# EAGLE design 2364-27c128 adapter (EAGLE 9.0.1)
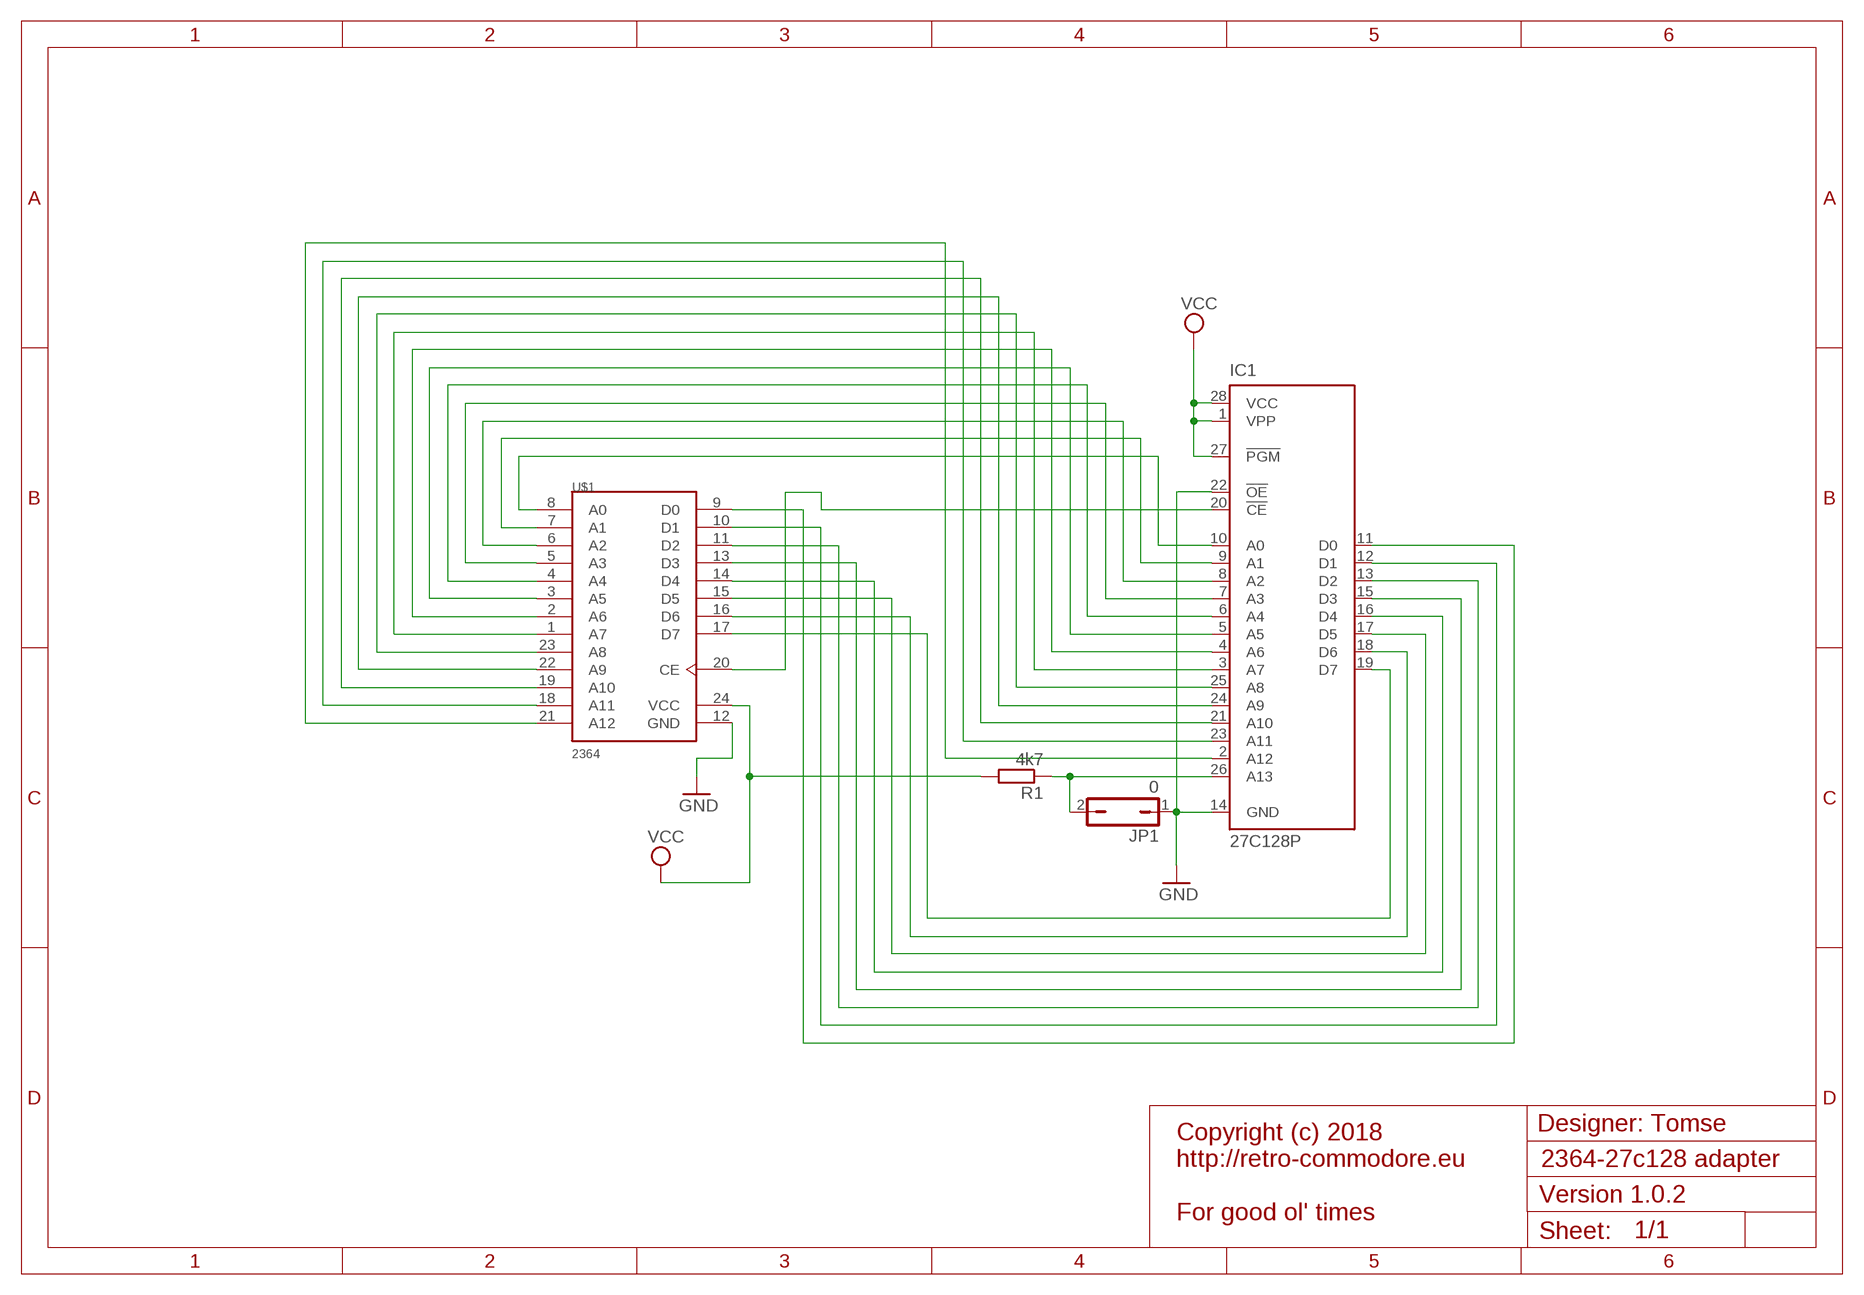
[diagram p0: schematic, sheet 1]

## Parts
IC1  27C128P  [DIL28-6]
JP1  0  JP1Q  [JP1]
R1  4k7  R-EU_0207/12  [0207/12]
U$1  2364  [DIP24]

## Nets
GND: IC1.14(GND) IC1.22(!OE) JP1.1 U$1.12(GND)
N$1: IC1.10(A0) U$1.8(A0)
N$2: IC1.9(A1) U$1.7(A1)
N$3: IC1.8(A2) U$1.6(A2)
N$4: IC1.7(A3) U$1.5(A3)
N$5: IC1.6(A4) U$1.4(A4)
N$6: IC1.5(A5) U$1.3(A5)
N$7: IC1.4(A6) U$1.2(A6)
N$8: IC1.3(A7) U$1.1(A7)
N$9: IC1.25(A8) U$1.23(A8)
N$10: IC1.24(A9) U$1.22(A9)
N$11: IC1.21(A10) U$1.19(A10)
N$12: IC1.23(A11) U$1.18(A11)
N$13: IC1.2(A12) U$1.21(A12)
N$14: IC1.19(D7) U$1.17(D7)
N$15: IC1.18(D6) U$1.16(D6)
N$16: IC1.17(D5) U$1.15(D5)
N$17: IC1.16(D4) U$1.14(D4)
N$18: IC1.15(D3) U$1.13(D3)
N$19: IC1.13(D2) U$1.11(D2)
N$20: IC1.12(D1) U$1.10(D1)
N$21: IC1.11(D0) U$1.9(D0)
N$22: IC1.20(!CE) U$1.20(CE)
N$24: IC1.26(A13) JP1.2 R1.1
VCC: IC1.1(VPP) IC1.27(!PGM) IC1.28(VCC) R1.2 U$1.24(VCC)

## Notes on the sheet
- Designer: Tomse
- Version 1.0.2
- Copyright (c) 2018
  http://retro-commodore.eu
  
  For good ol' times

## Library data of the parts
IC1 = microchip:27*128: CMOS EPROM 128 K (16 K x 8); OC_FARNELL: unknown; OC_NEWARK: unknown
JP1 = jumper:JP1Q: JUMPER
R1 = resistor:R-EU_: RESISTOR, European symbol
U$1 = 65xx_mos:2364

## Board
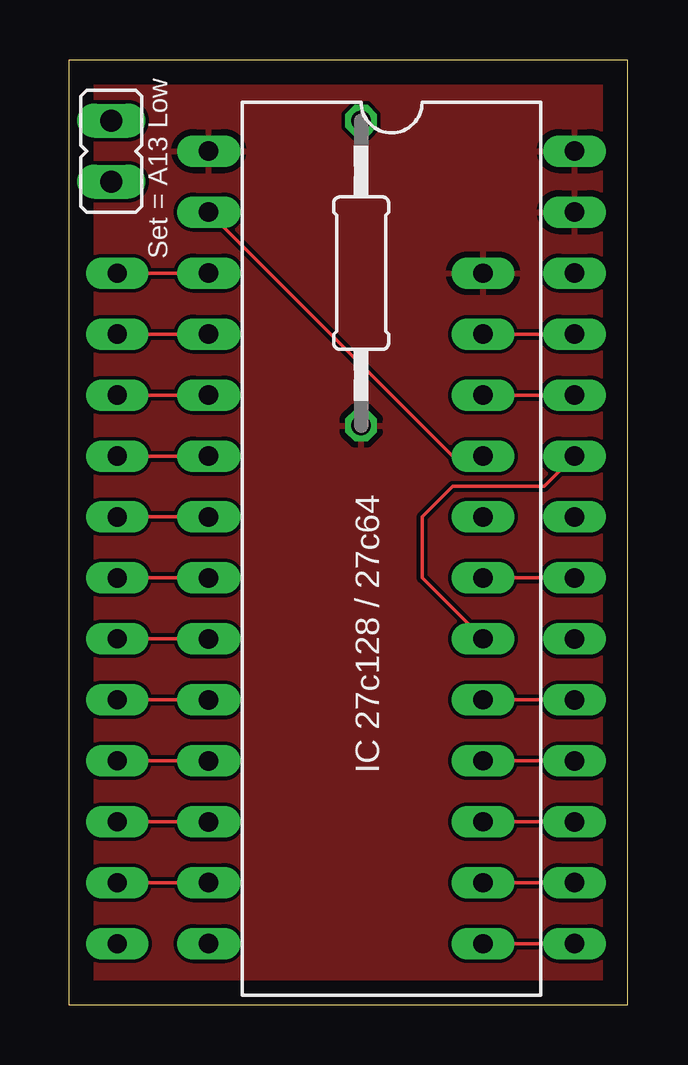
[diagram p1: board, top side]
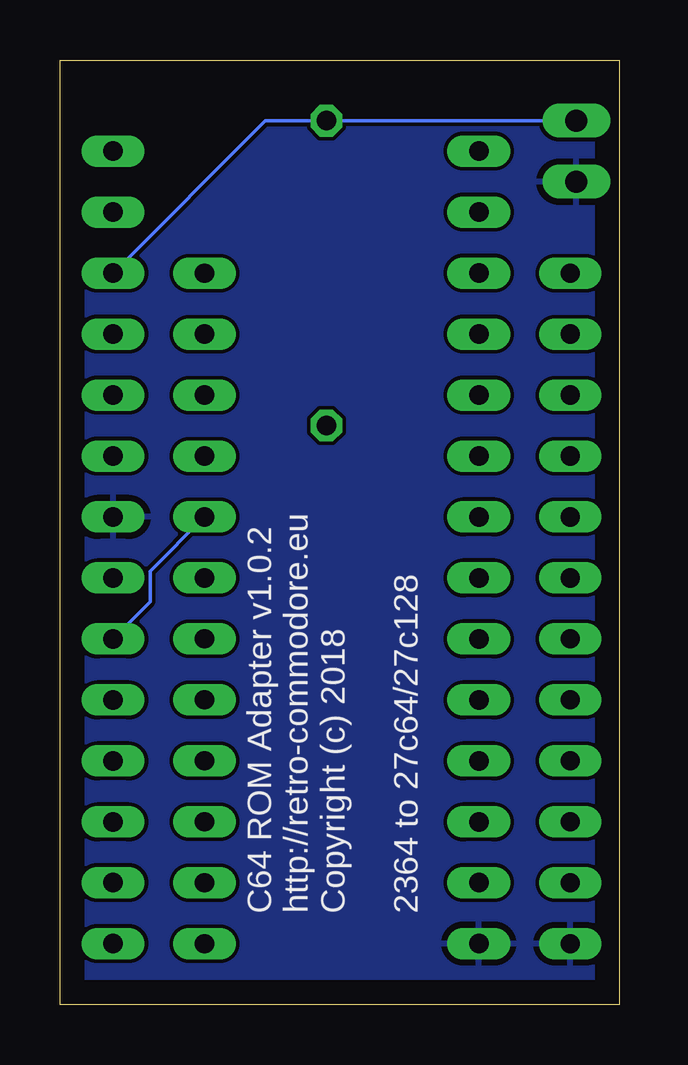
[diagram p2: board, bottom side, seen from below]

Size 23.29 x 39.36 mm. Coordinates in mm from the lower left corner, seen from the top.
Outline: 0,0 23.29,0 23.29,39.36 0,39.36 0,0
Copper layers (1*16): Top 0.035mm / dielectric 1.5mm / Bottom 0.035mm
Design rules "default": minimum track width 6mil, minimum drill 0.35mm, track to track 6mil, track to pad 6mil, pad to pad 6mil, via to via 6mil, smd to smd 6mil, copper to edge 40mil, drill to drill 6mil, minimum pad ring 10mil, minimum via ring 8mil, stop-mask expansion 4mil, vias tented up to drill 0mil, thermal gap 10mil

### Footprints (pad centres in the part's own frame; a part is rotated, then mirrored left to right if it is on the bottom)
DIL28-6 = drill 0.813 long: 1 -16.51,-7.62; 2 -13.97,-7.62; 3 -11.43,-7.62; 4 -8.89,-7.62; 5 -6.35,-7.62; 6 -3.81,-7.62; 7 -1.27,-7.62; 8 1.27,-7.62; 9 3.81,-7.62; 10 6.35,-7.62; 11 8.89,-7.62; 12 11.43,-7.62; 13 13.97,-7.62; 14 16.51,-7.62; 15 16.51,7.62; 16 13.97,7.62; 17 11.43,7.62; 18 8.89,7.62; 19 6.35,7.62; 20 3.81,7.62; 21 1.27,7.62; 22 -1.27,7.62; 23 -3.81,7.62; 24 -6.35,7.62; 25 -8.89,7.62; 26 -11.43,7.62; 27 -13.97,7.62; 28 -16.51,7.62
JP1 = drill 0.914 long: 1 0,-1.27; 2 0,1.27
0207/12 = drill 0.813 octagon: 1 -6.35,0; 2 6.35,0
DIP24 = drill 0.8 long: 1 -7.62,8.89; 2 -7.62,6.35; 3 -7.62,3.81; 4 -7.62,1.27; 5 -7.62,-1.27; 6 -7.62,-3.81; 7 -7.62,-6.35; 8 -7.62,-8.89; 9 -7.62,-11.43; 10 -7.62,-13.97; 11 -7.62,-16.51; 12 -7.62,-19.05; 13 7.62,-19.05; 14 7.62,-16.51; 15 7.62,-13.97; 16 7.62,-11.43; 17 7.62,-8.89; 18 7.62,-6.35; 19 7.62,-3.81; 20 7.62,-1.27; 21 7.62,1.27; 22 7.62,3.81; 23 7.62,6.35; 24 7.62,8.89

### Placement (x,y rotation side)
IC1  13.46,19.05 270 top
JP1  1.78,35.56 0 top
R1  12.19,30.48 270 top
U$1  9.65,21.59 0 top

### Tracks (layer width: path | path; a pad name or v marks a point on that pad's centre or on a via)
GND
  pour Bottom: -4.32,45.72 27.43,45.72 27.43,-2.54 -4.32,-2.54 -5.59,-1.27 -5.59,44.45
N$1
  Top 0.152: U$1.8 IC1.10
N$2
  Top 0.152: IC1.9 U$1.7
N$3
  Top 0.152: IC1.8 U$1.6
N$4
  Top 0.152: IC1.7 U$1.5
N$5
  Top 0.152: U$1.4 IC1.6
N$6
  Top 0.152: IC1.5 U$1.3
N$7
  Top 0.152: 2.15,27.94 U$1.2 IC1.4
N$8
  Top 0.152: U$1.1 IC1.3
N$9
  Top 0.152: U$1.23 IC1.25
N$10
  Top 0.152: U$1.22 IC1.24
N$11
  Top 0.152: U$1.19 IC1.21
N$12
  Top 0.152: U$1.18 14.73,17.78 14.73,20.32 16,21.59 19.81,21.59 IC1.23
N$13
  Top 0.152: IC1.2 16,22.86 U$1.21
N$14
  Top 0.152: U$1.17 IC1.19
N$15
  Top 0.152: U$1.16 IC1.18
N$16
  Top 0.152: U$1.15 IC1.17
N$17
  Top 0.152: U$1.14 IC1.16
N$18
  Top 0.152: U$1.13 IC1.15
N$19
  Top 0.152: IC1.13 U$1.11
N$20
  Top 0.152: U$1.10 IC1.12
N$21
  Top 0.152: IC1.11 U$1.9
N$22
  Bottom 0.152: IC1.20 19.53,16.79 19.53,18.06 U$1.20
N$24
  Bottom 0.152: JP1.2 R1.1 | R1.1 14.73,36.83 IC1.26 | 9.65,36.83 R1.1
VCC
  pour Top: -3.05,44.45 26.16,44.45 26.16,-1.27 -4.32,-1.27 -4.32,43.18

### Text on the board
tNames: Set = A13 Low | IC 27c128 / 27c64
bNames: C64 ROM Adapter v1.0.2 / http://retro-commodore.eu / Copyright (c) 2018 / / 2364 to 27c64/27c128